# EasyEDA Pro project Clock_EasyEDA_Project_File.epro, board PCB
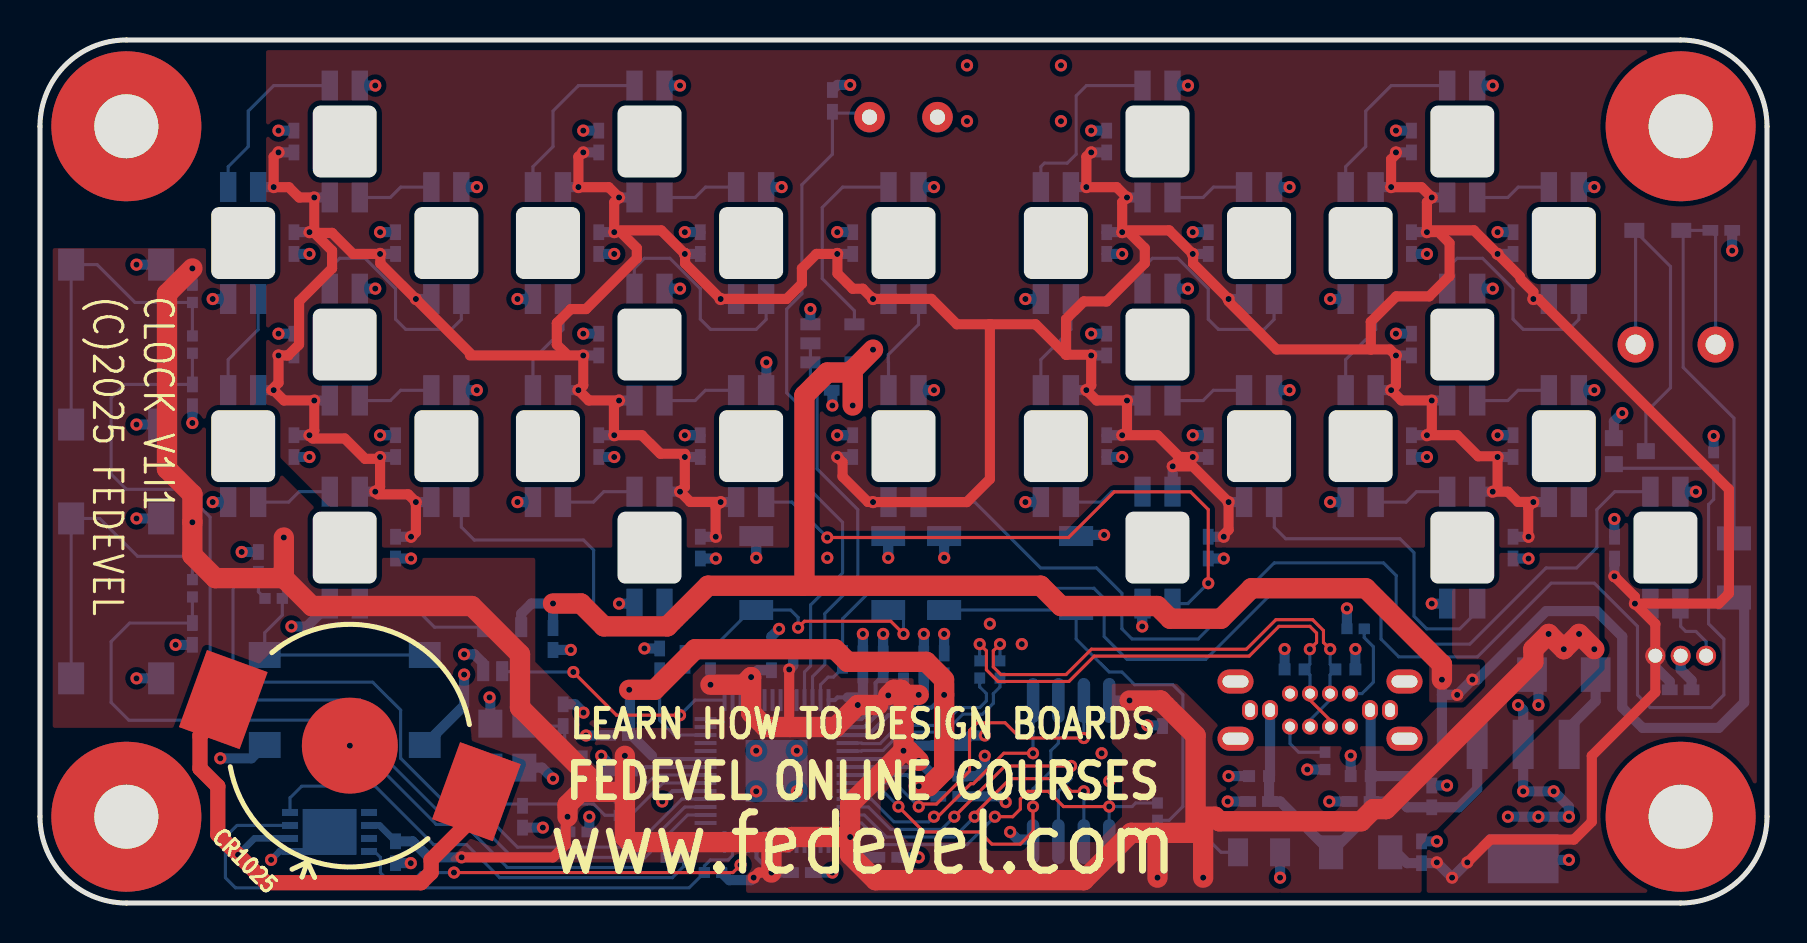
[diagram p2: board, top side]
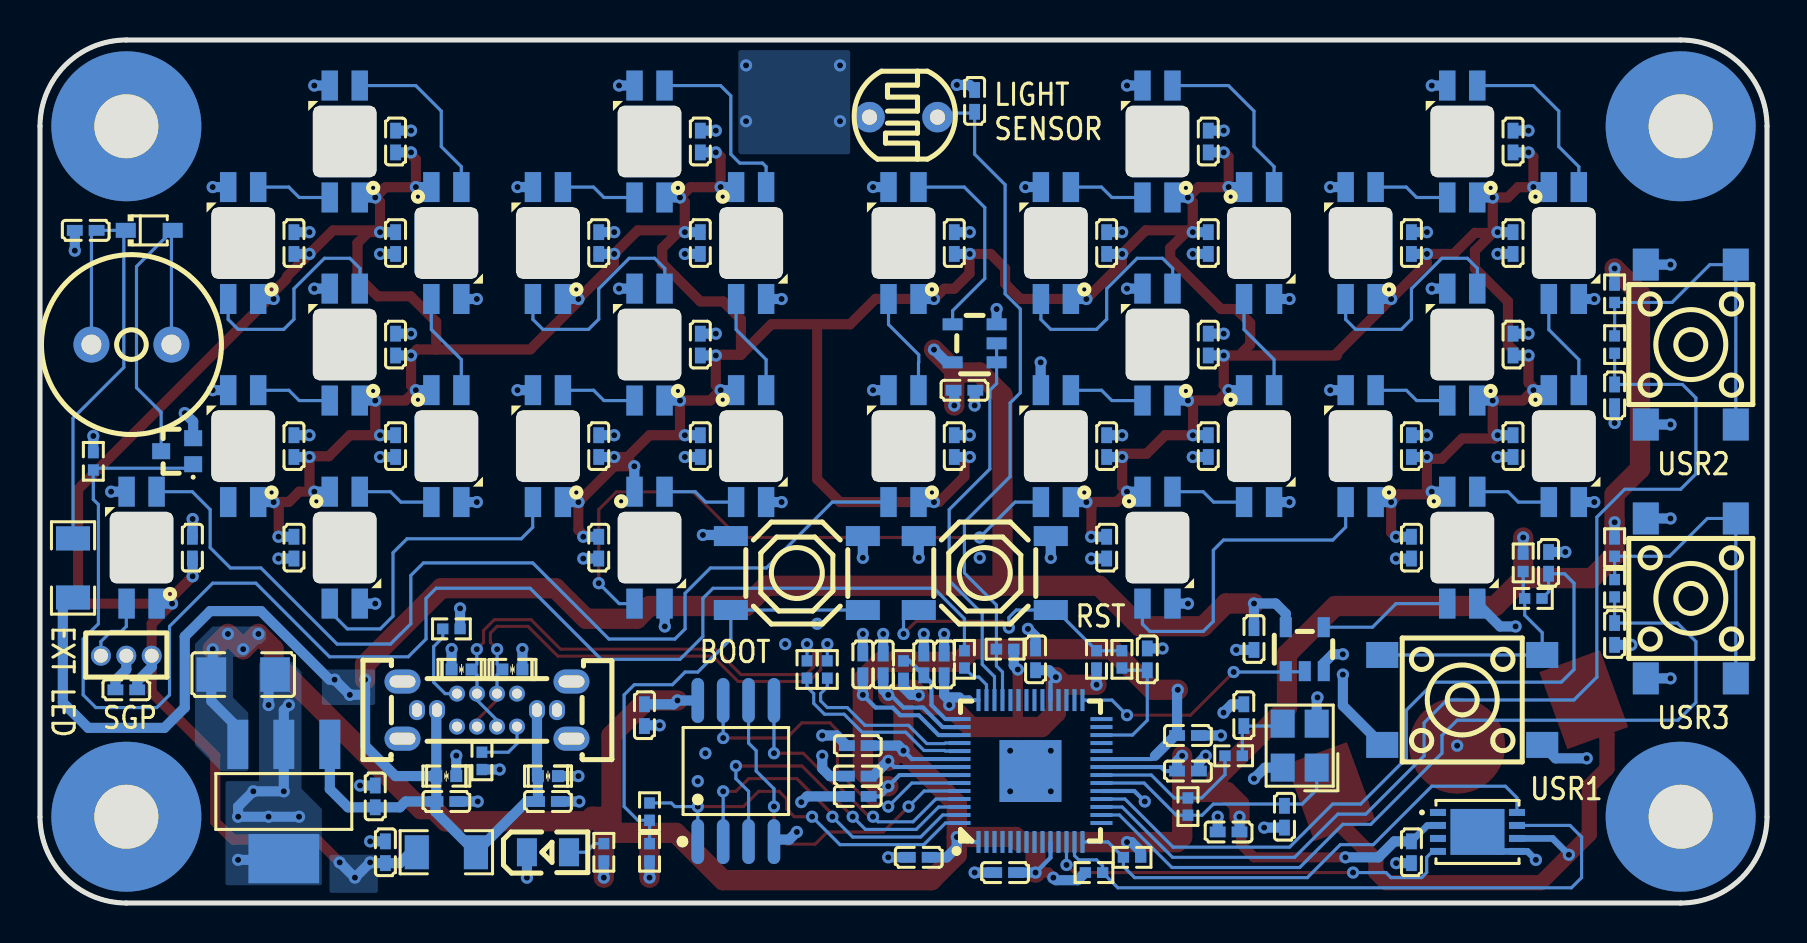
[diagram p3: board, bottom side, seen from below]

Outline 86.36 x 43.18 mm; copper layers: Top Layer, Inner1, Inner2, Bottom Layer. Coordinates in mm from the lower left corner of the outline.
Outline path: 0,38.86 0,4.32 arc(1.26,1.26) 4.32,0 82.04,0 arc(85.1,1.26) 86.36,4.32 86.36,38.86 arc(85.1,41.92) 82.04,43.18 4.32,43.18 arc(1.26,41.92) 0,38.86
Stack: Top Layer 0.035mm Outer layer thickness 1oz / Dielectric1 0.2104mm 7628 RC49% 8.6mil / Inner1 0.0152mm Inner layer thickness / Dielectric2 1.065mm 1.1mm H/HOZ Copper / Inner2 0.0152mm Inner layer thickness / Dielectric3 0.2104mm 7628 RC49% 8.6mil / Bottom Layer 0.035mm Outer layer thickness 1oz

## Design rules (mm)
net CON_USB_N: USB_CON
net CON_USB_P: USB_CON
net USB_N: USB
net USB_P: USB
template: User Custom Config
spacing copperThickness1oz (default): track to track 0.178, other pairs 0.076 to 0.305
spacing copperThickness2oz: track to track 0.203, other pairs 0.152 to 0.3
spacing copperThicknessInner0.5oz: track to track 0.089, other pairs 0.152 to 0.3
track width copperThickness1oz (default): min 0.152, default 0.203, max 2.54
track width copperThickness2oz: min 0.203, default 0.254, max 2.54
track width copperThickness0.5oz: min 0.089, default 0.254, max 2.54
differential pair differentialPair (default): width min 0.155, default 0.155, max 0.203; gap min 0.178, default 0.191
via viaSize (default): diameter min 0.61, default 0.61, max 10; hole min 0.305, default 0.305, max 6.299

## Placement (name value [footprint] x y rotation side)
BUZZER1  2.7kHz  [BUZ-TH_BD9.0-P4.00-D0.6-FD]  81.79 27.94 180 bottom
C101  2.2uF  [C0402]  26.92 3.56 180 bottom
C102  100nF  [C0402]  45.47 7.87 180 bottom
C103  100nF  [C0402]  45.47 6.35 180 bottom
C104  100nF  [C0402]  41.15 11.94 270 bottom
C105  2.2uF  [C0402]  42.16 11.94 270 bottom
C106  2.2uF  [C0402]  44.2 11.94 270 bottom
C107  2.2uF  [C0402]  45.21 11.94 270 bottom
C108  100nF  [C0402]  45.47 5.33 180 bottom
C109  100nF  [C0402]  28.96 8.38 0 bottom
C110  1uF  [C0402]  69.09 2.54 270 bottom
C111  1uF  [C0402]  69.6 5.33 270 bottom
C112  47uF  [C1206]  76.2 11.43 0 bottom
C113  100nF  [C0402]  36.58 12.19 270 bottom
C114  100nF  [C0402]  28.96 6.6 0 bottom
C115  100nF  [C0402]  38.1 1.52 180 bottom
C116  100nF  [C0402]  42.42 2.29 180 bottom
C118  1uF  [C0402]  60.96 5.08 0 bottom
C119  1uF  [C0402]  66.04 5.08 0 bottom
C123  15pF  [C0402]  24.13 4.32 270 bottom
C124  15pF  [C0402]  26.16 9.4 90 bottom
C125  100nF  [C0402]  25.65 13.21 90 bottom
C126  100nF  [C0402]  56.13 9.4 90 bottom
C127  100nF  [C0402]  30.99 12.19 270 bottom
C210  100nF  [C0402]  17.78 17.78 90 bottom
C211  100nF  [C0402]  12.7 22.86 90 bottom
C212  100nF  [C0402]  12.7 33.02 90 bottom
C213  100nF  [C0402]  12.7 38.1 270 bottom
C214  100nF  [C0402]  17.78 33.02 270 bottom
C215  100nF  [C0402]  12.7 27.94 270 bottom
C216  100nF  [C0402]  17.78 22.86 270 bottom
C217  100nF  [C0402]  33.02 17.78 90 bottom
C218  100nF  [C0402]  27.94 22.86 90 bottom
C219  100nF  [C0402]  27.94 33.02 90 bottom
C220  100nF  [C0402]  27.94 38.1 270 bottom
C221  100nF  [C0402]  33.02 33.02 270 bottom
C222  100nF  [C0402]  27.94 27.94 270 bottom
C223  100nF  [C0402]  33.02 22.86 270 bottom
C224  100nF  [C0402]  58.42 17.78 90 bottom
C225  100nF  [C0402]  53.34 22.86 90 bottom
C226  100nF  [C0402]  53.34 33.02 90 bottom
C227  100nF  [C0402]  53.34 38.1 270 bottom
C228  100nF  [C0402]  58.42 33.02 270 bottom
C229  100nF  [C0402]  53.34 27.94 270 bottom
C230  100nF  [C0402]  58.42 22.86 270 bottom
C231  100nF  [C0402]  73.66 17.78 90 bottom
C232  100nF  [C0402]  68.58 22.86 90 bottom
C233  100nF  [C0402]  68.58 33.02 90 bottom
C234  100nF  [C0402]  68.58 38.1 270 bottom
C235  100nF  [C0402]  73.66 33.02 270 bottom
C236  100nF  [C0402]  68.58 27.94 270 bottom
C237  100nF  [C0402]  73.66 22.86 270 bottom
C238  100nF  [C0402]  40.64 33.02 270 bottom
C239  100nF  [C0402]  40.64 22.86 270 bottom
C240  100nF  [C0402]  78.74 17.78 270 bottom
C241  100nF  [C0402]  82.04 10.67 180 bottom
C242  100nF  [C0402]  40.13 25.65 0 bottom
C243  1uF  [C0402]  84.07 33.66 180 bottom
C244  100nF  [C0402]  10.92 17.02 270 bottom
C245  100nF  [C0402]  7.62 25.4 90 bottom
C246  100nF  [C0402]  7.62 13.46 90 bottom
C247  15pF  [C0402]  39.62 40.13 270 bottom
C248  1uF  [C0402]  17.78 2.54 90 bottom
D101  GG0402052R542P  [D0402-BI]  60.96 6.35 0 bottom
D102  GG0402052R542P  [D0402-BI]  66.04 6.35 0 bottom
D103  GG0402052R542P  [D0402-BI]  62.74 11.68 0 bottom
D104  GG0402052R542P  [D0402-BI]  65.28 11.68 180 bottom
D105  1N4148WS  [SOD-323_L1.8-W1.3-LS2.5-RD]  80.9 33.66 180 bottom
J101  MC-110LD-L93  [USB-C-TH_MC-110LD-L93_1]  64.01 9.65 180 bottom
J201  1271WV-3P  [HDR-TH_3P-P1.27-V-M]  82.04 12.37 0 bottom
LED102  KT-0805G  [LED0805-R-RD]  60.96 2.54 180 bottom
LED201  SK6812MINI-E  [LED-SMD_L3.2-W2.8-TR]  15.24 17.78 90 bottom
LED202  SK6812MINI-E  [LED-SMD_L3.2-W2.8-TR]  10.16 22.86 90 bottom
LED203  SK6812MINI-E  [LED-SMD_L3.2-W2.8-TR]  10.16 33.02 90 bottom
LED204  SK6812MINI-E  [LED-SMD_L3.2-W2.8-TR]  15.24 38.1 270 bottom
LED205  SK6812MINI-E  [LED-SMD_L3.2-W2.8-TR]  20.32 33.02 270 bottom
LED206  SK6812MINI-E  [LED-SMD_L3.2-W2.8-TR]  15.24 27.94 270 bottom
LED207  SK6812MINI-E  [LED-SMD_L3.2-W2.8-TR]  20.32 22.86 270 bottom
LED208  SK6812MINI-E  [LED-SMD_L3.2-W2.8-TR]  30.48 17.78 90 bottom
LED209  SK6812MINI-E  [LED-SMD_L3.2-W2.8-TR]  25.4 22.86 90 bottom
LED210  SK6812MINI-E  [LED-SMD_L3.2-W2.8-TR]  25.4 33.02 90 bottom
LED211  SK6812MINI-E  [LED-SMD_L3.2-W2.8-TR]  30.48 38.1 270 bottom
LED212  SK6812MINI-E  [LED-SMD_L3.2-W2.8-TR]  35.56 33.02 270 bottom
LED213  SK6812MINI-E  [LED-SMD_L3.2-W2.8-TR]  30.48 27.94 270 bottom
LED214  SK6812MINI-E  [LED-SMD_L3.2-W2.8-TR]  35.56 22.86 270 bottom
LED215  SK6812MINI-E  [LED-SMD_L3.2-W2.8-TR]  55.88 17.78 90 bottom
LED216  SK6812MINI-E  [LED-SMD_L3.2-W2.8-TR]  50.8 22.86 90 bottom
LED217  SK6812MINI-E  [LED-SMD_L3.2-W2.8-TR]  50.8 33.02 90 bottom
LED218  SK6812MINI-E  [LED-SMD_L3.2-W2.8-TR]  55.88 38.1 270 bottom
LED219  SK6812MINI-E  [LED-SMD_L3.2-W2.8-TR]  60.96 33.02 270 bottom
LED220  SK6812MINI-E  [LED-SMD_L3.2-W2.8-TR]  55.88 27.94 270 bottom
LED221  SK6812MINI-E  [LED-SMD_L3.2-W2.8-TR]  60.96 22.86 270 bottom
LED222  SK6812MINI-E  [LED-SMD_L3.2-W2.8-TR]  71.12 17.78 90 bottom
LED223  SK6812MINI-E  [LED-SMD_L3.2-W2.8-TR]  66.04 22.86 90 bottom
LED224  SK6812MINI-E  [LED-SMD_L3.2-W2.8-TR]  66.04 33.02 90 bottom
LED225  SK6812MINI-E  [LED-SMD_L3.2-W2.8-TR]  71.12 38.1 270 bottom
LED226  SK6812MINI-E  [LED-SMD_L3.2-W2.8-TR]  76.2 33.02 270 bottom
LED227  SK6812MINI-E  [LED-SMD_L3.2-W2.8-TR]  71.12 27.94 270 bottom
LED228  SK6812MINI-E  [LED-SMD_L3.2-W2.8-TR]  76.2 22.86 270 bottom
LED229  SK6812MINI-E  [LED-SMD_L3.2-W2.8-TR]  43.18 33.02 270 bottom
LED230  SK6812MINI-E  [LED-SMD_L3.2-W2.8-TR]  43.18 22.86 270 bottom
LED231  SK6812MINI-E  [LED-SMD_L3.2-W2.8-TR]  81.28 17.78 270 bottom
MH205  -  [MH_7.5X3.2MM_RF_v1.0]  4.32 4.32 0 top
MH206  -  [MH_7.5X3.2MM_RF_v1.0]  82.04 4.32 0 top
MH207  -  [MH_7.5X3.2MM_RF_v1.0]  4.32 38.86 0 top
MH208  -  [MH_7.5X3.2MM_RF_v1.0]  82.04 38.86 0 top
Q1  2N7002BKW,115  [SOT-323_L2.0-W1.3-P1.30-LS2.1-BR]  79.5 22.61 180 bottom
R101  200Ω  [R0402]  43.18 11.68 90 bottom
R102  100mΩ  [R1206]  66.04 2.54 0 bottom
R104  1kΩ  [R0402]  58.17 2.54 270 bottom
R109  27Ω  [R0402]  46.99 11.68 270 bottom
R111  27Ω  [R0402]  48.01 11.68 270 bottom
R118  5.1kΩ  [R0402]  65.79 13.72 0 bottom
R119  5.1kΩ  [R0402]  64.26 7.11 90 bottom
R120  1MΩ  [R0402]  28.96 4.83 270 bottom
R121  1kΩ  [R0402]  26.67 7.37 0 bottom
R122  100kΩ  [R0402]  55.88 2.54 270 bottom
R123  10kΩ  [R0402]  33.53 12.19 270 bottom
R124  1kΩ  [R0402]  55.88 4.57 90 bottom
R125  27Ω  [R0402]  32.26 12.19 270 bottom
R126  27Ω  [R0402]  40.13 12.19 90 bottom
R127  150Ω  [R1206]  84.71 16.76 270 bottom
R128  10kΩ  [R0402]  83.69 22.1 270 bottom
R129  10kΩ  [R0402]  12.19 17.02 90 bottom
R130  27Ω  [R0402]  11.68 15.24 180 bottom
R131  10kΩ  [R0402]  7.62 30.48 90 bottom
R132  27Ω  [R0402]  7.62 27.94 270 bottom
R133  10kΩ  [R0402]  7.62 17.78 90 bottom
R134  27Ω  [R0402]  7.62 15.75 270 bottom
R135  GL5528(10-20)  [RES-TH_L5.1-W4.3-P3.40-D0.5]  43.18 39.32 270 bottom
R136  10kΩ  [R0402]  38.1 12.7 180 bottom
R137  10kΩ  [R0402]  31.75 2.29 180 bottom
R138  10kΩ  [R0402]  33.65 1.52 0 bottom
SW101  TS-1187A-B-A-B  [SW-SMD_4P-L5.1-W5.1-P3.70-LS6.5-TL-2]  48.51 16.51 180 bottom
SW102  TS-1187A-B-A-B  [SW-SMD_4P-L5.1-W5.1-P3.70-LS6.5-TL-2]  39.12 16.51 180 bottom
SW103  DTSM-62K-V-T/R  [KEY-SMD_4P-L6.2-W6.2-P4.50-LS9.0]  15.24 10.16 0 bottom
SW104  DTSM-62K-V-T/R  [KEY-SMD_4P-L6.2-W6.2-P4.50-LS9.0]  3.81 27.94 90 bottom
SW105  DTSM-62K-V-T/R  [KEY-SMD_4P-L6.2-W6.2-P4.50-LS9.0]  3.81 15.24 90 bottom
U101  RP2040  [LQFN-56_L7.0-W7.0-P0.4-EP_1]  36.83 6.6 90 bottom
U102  LM3940IMP-3.3/NOPB  [SOT-223_L6.5-W3.5-P2.30-LS7.0-BR]  74.17 5.08 90 bottom
U103  SN74LV1T34DBVR  [SOT-23-5_L2.9-W1.6-P0.95-LS2.8-BR]  23.11 12.7 270 bottom
U104  W25Q128JVSIQ  [SOIC-8_L5.3-W5.3-P1.27-LS8.0-BL]  51.56 6.6 180 bottom
U105  SN74LV1T34DBVR  [SOT-23-5_L2.9-W1.6-P0.95-LS2.8-BR]  39.62 28 180 bottom
U106  MAX31343ETAY+T  [TDFN-8_L4.0-W3.0-P0.50-BL-EP]  14.48 3.56 270 bottom
U107  MY-1025-01  [BAT-SMD_MY-1025-01_1]  15.49 7.87 160 top
Y101  ABM8-272-T3  [CRYSTAL-SMD_4P-L3.2-W2.5-BL]  23.37 7.87 90 bottom

## Footprints (pads in the part's own frame, mm; a bottom-side part is the same pattern mirrored in y, then rotated)
BAT-SMD_MY-1025-01_1
  rect 3.23x4.1 smd: 1(-6.735,0) 2(6.735,0)
  round 4.8 smd: 3(0,0)
BUZ-TH_BD9.0-P4.00-D0.6-FD
  round 1.8 hole 1: 1(-2,0) 2(2,0)
C0402
  rect 0.79x0.54 smd: 1(-0.545,0) 2(0.545,0)
C1206
  rect 1.485x1.728 smd: 1(-1.593,0) 2(1.593,0)
CRYSTAL-SMD_4P-L3.2-W2.5-BL
  rect 1.4x1.2 smd: 1(-1.1,-0.85) 2(1.1,-0.85) 3(1.1,0.85) 4(-1.1,0.85)
D0402-BI
  rect 0.6x0.6 smd: 1(-0.5,0) 2(0.5,0)
HDR-TH_3P-P1.27-V-M
  round 1 hole 0.7: 1(-1.27,0) 2(0,0) 3(1.27,0)
KEY-SMD_4P-L6.2-W6.2-P4.50-LS9.0
  rect 1.6x1.3 smd: 1(-4,2.25) 2(4,2.25) 3(-4,-2.25) 4(4,-2.25)
LED0805-R-RD
  rect 1x1.399 smd: 1(1.05,0) 2(-1.05,0)
LED-SMD_L3.2-W2.8-TR
  rect 1.5x0.82 smd: 1(2.8,0.75) 2(2.8,-0.75) 3(-2.8,-0.75) 4(-2.8,0.75)
LQFN-56_L7.0-W7.0-P0.4-EP_1
  rect 1.1x0.2 smd: 1(-3.55,2.6) 2(-3.55,2.2) 3(-3.55,1.8) 4(-3.55,1.4) 5(-3.55,1) 6(-3.55,0.6) 7(-3.55,0.2) 8(-3.55,-0.2) 9(-3.55,-0.6) 10(-3.55,-1) 11(-3.55,-1.4) 12(-3.55,-1.8) 13(-3.55,-2.2) 14(-3.55,-2.6) 29(3.55,-2.6) 30(3.55,-2.2) 31(3.55,-1.8) 32(3.55,-1.4) 33(3.55,-1) 34(3.55,-0.6) 35(3.55,-0.2) 36(3.55,0.2) 37(3.55,0.6) 38(3.55,1) 39(3.55,1.4) 40(3.55,1.8) 41(3.55,2.2) 42(3.55,2.6)
  rect 0.2x1.1 smd: 15(-2.6,-3.55) 16(-2.2,-3.55) 17(-1.8,-3.55) 18(-1.4,-3.55) 19(-1,-3.55) 20(-0.6,-3.55) 21(-0.2,-3.55) 22(0.2,-3.55) 23(0.6,-3.55) 24(1,-3.55) 25(1.4,-3.55) 26(1.8,-3.55) 27(2.2,-3.55) 28(2.6,-3.55) 43(2.6,3.55) 44(2.2,3.55) 45(1.8,3.55) 46(1.4,3.55) 47(1,3.55) 48(0.6,3.55) 49(0.2,3.55) 50(-0.2,3.55) 51(-0.6,3.55) 52(-1,3.55) 53(-1.4,3.55) 54(-1.8,3.55) 55(-2.2,3.55) 56(-2.6,3.55)
  rect 3.1x3.1 smd: 57(0,0)
MH_7.5X3.2MM_RF_v1.0
  round 7.5 hole 3.2: 1(0,0)
R0402
  rect 0.566x0.54 smd: 1(-0.433,0) 2(0.433,0)
R1206
  rect 1.208x1.701 smd: 1(-1.479,0) 2(1.479,0)
RES-TH_L5.1-W4.3-P3.40-D0.5
  round 1.524 hole 0.762: 1(0,1.7) 2(0,-1.7)
SOD-323_L1.8-W1.3-LS2.5-RD
  rect 1x0.75 smd: 1(-1.173,0) 2(1.173,0)
SOIC-8_L5.3-W5.3-P1.27-LS8.0-BL
  oval 0.63x2.25 smd: 1(-1.905,-3.53) 2(-0.635,-3.53) 3(0.635,-3.53) 4(1.905,-3.53) 5(1.905,3.53) 6(0.635,3.53) 7(-0.635,3.53) 8(-1.905,3.53)
SOT-23-5_L2.9-W1.6-P0.95-LS2.8-BR
  rect 1x0.6 smd: 1(1.1,-0.95) 2(1.1,0) 3(1.1,0.95) 4(-1.1,0.95) 5(-1.1,-0.95)
SOT-223_L6.5-W3.5-P2.30-LS7.0-BR
  rect 2.465x1.05 smd: 1(2.857,-2.3) 2(2.857,0) 3(2.857,2.3)
  rect 2.465x3.54 smd: 4(-2.857,0)
SOT-323_L2.0-W1.3-P1.30-LS2.1-BR
  rect 0.9x0.8 smd: 1(0.8,-0.65) 2(0.8,0.65) 3(-0.8,0)
SW-SMD_4P-L5.1-W5.1-P3.70-LS6.5-TL-2
  rect 1.7x1 smd: 1(-3.3,1.85) 2(3.3,1.85) 3(-3.3,-1.85) 4(3.3,-1.85)
TDFN-8_L4.0-W3.0-P0.50-BL-EP
  rect 0.35x0.8 smd: 1(-0.975,-1.975) 2(-0.325,-1.975) 3(0.325,-1.975) 4(0.975,-1.975) 5(0.975,1.975) 6(0.325,1.975) 7(-0.325,1.975) 8(-0.975,1.975)
  rect 2.3x2.7 smd: 9(0,0)
USB-C-TH_MC-110LD-L93_1
  oval 1.8x1.2 hole 1.3x0.6: 13(-4.225,-1.43) 13(-4.225,1.43) 13(4.225,-1.43) 13(4.225,1.43)
  oval 0.8x1 hole 0.5x0.7: A1B12(3.5,0) A4B9(2.5,0) A9B4(-2.5,0) A12B1(-3.5,0)
  round 0.8 hole 0.5: A5(1.5,-0.825) A6(0.5,-0.825) A7(-0.5,-0.825) A8(-1.5,-0.825) B5(-1.5,0.825) B6(-0.5,0.825) B7(0.5,0.825) B8(1.5,0.825)

## Nets
As in the schematic.

Pads without a net: J101 A8 B8; LED228 2; U101 2 3 4 5 6 7 8 9 11 15 24 25 27 28 30 31 32 34 35 36 37 38; U106 1 3

## Via types
v1: diameter 0.61, hole 0.305, Top Layer to Bottom Layer, 263 vias

## Routing (per net, layer and track width the routed paths; a pad name or vN(x,y) marks a point on that pad's centre or on a via; arc(x,y) is an arc through that point)
+1V1: length 41.5
  Top Layer w1.016: 45.21,11.18 44.32,12.06 40.39,12.06 39.75,12.7 32.77,12.7 30.73,10.67 v1(29.46,10.67) ; 45.21,10.98 v1(45.21,10.41) 45.21,6.6 44.45,5.84 v1(43.94,5.84)
  Bottom Layer w0.205: U101.50 43.38,6.4 v1(43.94,5.84) 43.94,5.72 44.32,5.33 C108.2 ; U101.45 41.42,8.4 42.42,9.4 43.34,9.4 43.72,9.78 44.58,9.78 v1(45.21,10.41) ; 30.61,7.37 30.77,7.2 U101.23
  Bottom Layer w0.508: 30.61,7.37 29.59,8.38 C109.2 29.5,10.63 v1(29.46,10.67) ; C107.2 v1(45.21,10.41)
+3V3: length 213.2
  Top Layer w0.508: 37.51,8.81 37.46,8.85 v1(37.46,11.68) ; v1(35.69,1.27) 35.94,1.52 v1(36.58,1.52) ; v1(21.08,2.29) 25.65,2.29 26.29,2.92 26.29,4.23 v1(26.38,4.32)
  Top Layer w1.016: 41.91,9.91 v1(40.89,9.91) 39.79,8.81 36.28,8.81 35.56,9.53 v1(35.56,11.3) 35.18,10.92 v1(33.53,10.92) ; 57.79,3.92 57.79,3.51 55.87,3.51 ; 57.79,3.92 57.93,4.06 ; 57.79,3.92 57.79,8.38 56.03,10.13 v1(54.48,10.13) ; 12.19,16.26 13.59,14.86 21.59,14.86 24,12.45 24,9.78 27.52,6.26 27.52,5.56 ; 12.19,16.26 8.76,16.26 7.62,17.4 v1(7.62,19.05) 7.62,20.45 6.35,21.72 6.35,30.48 v1(7.62,31.75) ; 12.19,16.26 v1(12.19,18.29) ; 27.52,5.56 29.25,5.56 ; 27.52,5.56 27.03,5.56 26.38,4.92 v1(26.38,4.32) ; 29.25,5.56 v1(29.25,7.37) ; 29.25,5.56 29.25,3.3 29.5,3.05 v1(32,3.05) 36.51,3.05 ; 36.51,3.05 36.58,2.98 v1(36.58,1.52) ; 36.51,3.05 37.34,3.05 37.59,3.3 v1(40.51,3.3) ; 57.93,4.06 58.17,3.83 v1(58.17,1.27) ; 57.93,4.06 58.19,4.32 58.75,4.32 58.98,4.09 66.07,4.09 66.67,4.7 67.31,4.7 74.68,12.07 74.68,12.7 v1(75.44,13.46) v1(76.2,12.7) v1(76.96,13.46) v1(77.72,12.7) ; v1(43.18,7.62) 43.18,10.29 43.31,10.41 ; v1(43.18,7.62) 43.43,7.62 v1(43.94,7.11) ; v1(43.18,7.62) 40.51,4.95 v1(40.51,3.3) ; 55.87,3.51 55.88,3.5 v1(55.88,1.27) ; 55.87,3.51 54.56,3.51 52.2,1.14 41.78,1.14 40.51,2.41 v1(40.51,3.3) ; 43.31,10.41 43.05,10.67 42.7,10.67 v1(42.42,10.39) ; 43.31,10.41 v1(43.94,10.41)
  Bottom Layer w0.205: C114.2 30.1,6.6 30.3,6.8 U101.22 ; v1(35.56,11.3) 35.83,11.03 U101.33 ; v1(43.94,7.11) 43.63,6.8 U101.49 ; U101.42 39.74,10.15 39.88,10.29 40.39,10.29 ; U101.10 35.83,2.27 v1(36.58,1.52) ; v1(43.94,10.41) 43.82,10.41 43.18,9.78 42.2,9.78 41.22,8.8 U101.44 ; v1(43.18,7.62) 42.76,7.2 U101.48 ; v1(40.51,3.3) 40.01,3.3 39.76,3.05 U101.1
  Bottom Layer w0.33: C248.2 16.98,3.88 16.45,3.88
  Bottom Layer w0.508: 40.39,10.29 41.02,10.29 ; 41.02,10.29 40.89,10.16 v1(40.89,9.91) ; 41.02,10.29 41.15,10.41 C104.2 ; v1(40.51,3.3) 40.51,2.79 41.02,2.29 C116.2 ; v1(35.56,11.3) 35.9,11.65 C113.2 ; R122.2 v1(55.88,1.27) ; R137.2 31.32,2.58 31.78,3.05 v1(32,3.05) ; C114.2 29.5,7.11 v1(29.25,7.37) ; R123.2 v1(33.53,10.92) ; U104.8 v1(54.48,10.13) 54.67,9.94 C126.2 ; C106.2 44.2,10.67 v1(43.94,10.41) ; v1(43.94,7.11) 44.7,6.35 C103.2 ; C101.2 v1(26.38,4.32) ; R133.2 v1(7.62,19.05) ; R131.2 v1(7.62,31.75) ; 43.18,11.25 43.18,10.8 42.8,10.41 42.42,10.41 ; R138.2 34.47,1.14 35.56,1.14 v1(35.69,1.27) ; C115.2 v1(36.58,1.52) ; C102.2 43.43,7.87 v1(43.18,7.62) ; R136.2 37.67,11.89 v1(37.46,11.68) ; C248.2 18.63,3.09 19.43,2.29 v1(21.08,2.29) ; U102.3 76.47,8.78 77.79,10.1 C112.2 77.72,11.5 v1(77.72,12.7) ; R104.2 v1(58.17,1.27) ; R129.2 v1(12.19,18.29)
+3V3_A: length 4.7
  Bottom Layer w0.205: U101.43 41.08,9.2 41.78,9.91 41.78,11.01 C105.2 42.89,12.12 R101.2
+3V_BAT: length 27.4
  Top Layer w0.762: 9.16,10.18 9.16,9.55 8,8.38 8,6.73 8.89,5.84 8.89,3.43 v1(9.91,2.41) 11.3,1.02 19.05,1.02 19.56,1.52 19.56,2.16 21.82,4.42 21.82,5.57
  Bottom Layer w0.33: v1(9.91,2.41) 10.72,3.23 U106.6
+5V_LEDS: length 308.3
  Top Layer w0.508: v1(41.66,30.22) 41.14,30.73 40.64,30.73 39.88,31.5 39.88,32.51 ; 51.31,27.43 49.78,28.96 47.5,28.96 ; 51.31,27.43 52.53,27.43 v1(52.57,27.4) 52.57,25.9 52.33,25.66 ; 51.31,27.43 51.31,29.21 52.2,30.1 53.34,30.1 55.24,32 55.24,32.77 54.45,33.56 v1(54.11,33.56) ; 28.7,23.5 28.7,24.89 v1(28.96,25.14) ; 54.14,23.41 55.88,23.41 56.93,22.35 ; 54.14,23.41 v1(54.11,23.41) ; 54.14,23.41 54.36,23.62 v1(54.36,25.14) ; v1(32.25,32.48) 31.07,33.66 28.71,33.66 28.71,35.06 28.95,35.3 ; 74.55,20.07 73.91,20.07 73.4,20.58 v1(72.64,20.58) ; 26.93,25.66 27.17,25.9 v1(27.17,27.4) 21.5,27.4 ; 26.93,25.66 27.44,25.15 28.83,25.15 ; 26.93,25.66 v1(26.92,25.66) ; 13.49,23.39 13.72,23.62 v1(13.72,25.14) ; 13.49,23.39 13.64,23.24 15.24,23.24 16.26,22.23 17.01,22.23 ; 13.49,23.39 v1(13.47,23.41) ; 32.26,22.48 31.02,22.48 30.1,23.41 v1(28.71,23.41) ; 52.33,25.66 52.84,25.15 54.36,25.15 ; 52.33,25.66 v1(52.32,25.66) ; v1(11.68,35.82) 11.68,37.34 11.94,37.59 ; v1(72.89,22.31) 72.89,20.69 ; 13.72,33.81 13.72,35.18 ; 79.76,14.98 79.76,14.99 79.76,15.32 v1(78.73,16.35) ; 79.76,14.98 83.95,14.98 84.45,15.49 84.45,20.7 74.93,30.23 74.68,30.23 ; 79.76,14.98 v1(79.76,14.98) ; 79.76,14.98 80.77,13.97 J201.1 80.77,10.54 77.6,7.37 77.6,4.06 76.71,3.18 72.52,3.18 v1(71.37,2.03) ; 16.77,20.58 17.01,20.82 17.01,22.23 ; 16.77,20.58 16.9,20.45 18.41,20.45 18.8,20.07 ; 16.77,20.58 v1(16.76,20.58) ; v1(28.71,33.56) 29.05,33.56 29.84,32.77 29.84,32.26 27.3,29.72 26.54,29.72 25.84,29.02 25.84,27.94 26.35,27.43 ; 11.56,25.65 11.93,26.02 v1(11.93,27.4) 12.41,27.4 12.95,27.94 12.95,30.1 14.61,31.75 14.61,32.64 13.72,33.53 ; v1(28.96,35.3) 28.95,35.3 ; 28.95,35.3 28.44,35.81 26.92,35.81 ; 52.58,37.59 52.32,37.34 v1(52.32,35.82) ; v1(69.35,23.41) 69.38,23.41 ; 69.38,23.41 70.87,23.41 71.92,22.35 72.9,22.35 ; 69.38,23.41 69.6,23.62 v1(69.6,25.14) ; 74.68,30.23 v1(74.68,30.22) ; 74.68,30.23 74.68,30.58 74.03,31.22 ; 32.01,20.58 32.25,20.82 v1(32.25,22.31) ; 32.01,20.58 32.52,20.07 33.91,20.07 ; 32.01,20.58 v1(32,20.58) ; 21.56,27.46 v1(18.8,30.22) 17.02,32 17.02,32.39 ; v1(13.72,35.3) 12.96,35.3 12.45,35.81 11.68,35.81 ; 11.93,27.43 11.94,27.43 ; 41.66,20.07 41.4,20.07 40.13,21.34 40.13,22.05 v1(39.87,22.31) ; 13.72,33.53 13.68,33.56 v1(13.47,33.56) ; 13.72,33.53 14.61,33.53 15.66,32.48 v1(17.01,32.48) ; 34.04,30.23 37.34,30.23 38.1,30.99 38.1,31.75 38.83,32.48 v1(39.87,32.48) ; 69.59,35.3 69.35,35.06 69.35,33.66 71.71,33.66 v1(72.89,32.48) 74.01,31.35 ; 69.59,35.3 v1(69.6,35.3) ; 69.59,35.3 69.08,35.81 67.56,35.81 ; v1(17.01,22.31) 17.01,22.23 ; 66.55,27.7 61.84,27.7 59.44,30.1 ; 66.55,27.7 67.5,27.7 v1(67.81,27.4) 67.81,25.9 67.57,25.66 ; 66.55,27.7 66.55,29.08 67.82,30.35 69.47,30.35 70.48,31.37 70.48,33.02 69.94,33.56 v1(69.35,33.56) ; 47.5,28.96 47.5,21.21 46.35,20.06 v1(41.66,20.06) ; 47.5,28.96 45.85,28.96 44.58,30.23 41.66,30.23 ; 54.35,35.3 53.84,35.81 52.32,35.81 ; 54.35,35.3 v1(54.36,35.3) ; 54.35,35.3 54.11,35.06 54.11,33.66 56.47,33.66 v1(57.65,32.48) ; v1(59.44,30.22) 57.66,32 57.66,32.51 ; 74.42,18.29 74.42,19.81 v1(74.68,20.06) ; 57.66,22.31 v1(57.65,22.31) 57.11,22.31 ; 57.11,22.31 56.93,22.31 ; 57.11,22.31 v1(56.64,21.85) 57.65,21.85 v1(59.44,20.06) 59.44,18.67 59.18,18.42 ; 27.05,37.47 26.92,37.34 v1(26.92,35.82) ; v1(11.68,25.66) 12.2,25.15 13.72,25.15 ; 33.78,18.42 33.78,19.81 v1(34.04,20.06) ; 67.57,25.66 68.08,25.15 69.6,25.15 ; 67.57,25.66 v1(67.56,25.66) ; 18.54,18.29 18.8,18.54 v1(18.8,20.06) ; 32.26,32.51 32.26,32 v1(34.04,30.22) ; 67.82,37.47 67.56,37.21 v1(67.56,35.82)
  Bottom Layer w0.508: C211.2 v1(13.47,23.41) ; C241.2 81.5,11.09 80.77,11.81 J201.1 ; 12.7,33.56 v1(13.47,33.56) ; C227.2 v1(52.57,37.56) ; C223.2 v1(32.25,22.31) ; v1(78.73,16.35) 78.73,17.22 C240.2 ; C214.2 v1(17.01,32.48) ; LED218.1 v1(54.36,35.3) ; C234.2 v1(67.81,37.56) ; LED210.1 v1(26.92,35.82) ; LED213.1 v1(28.96,25.14) ; 68.58,33.56 v1(69.35,33.56) ; LED223.1 v1(67.56,25.66) ; 68.58,27.4 v1(67.81,27.4) ; LED215.1 56.64,20.59 v1(56.64,21.85) ; C239.2 v1(39.87,22.31) ; LED207.1 v1(18.8,20.06) ; 27.94,27.4 v1(27.17,27.4) ; LED217.1 v1(52.32,35.82) ; LED209.1 v1(26.92,25.66) ; C225.2 v1(54.11,23.41) ; LED229.1 v1(41.66,30.22) ; LED219.1 v1(59.44,30.22) ; C237.2 v1(72.89,22.31) ; C235.2 v1(72.89,32.48) ; LED211.1 v1(28.96,35.3) ; 12.7,27.4 v1(11.93,27.4) ; LED204.1 v1(13.72,35.3) ; LED205.1 v1(18.8,30.22) ; C224.2 v1(59.19,18.33) ; LED202.1 v1(11.68,25.66) ; LED226.1 v1(74.68,30.22) ; C213.2 v1(11.93,37.56) ; C228.2 v1(57.65,32.48) ; LED231.1 v1(79.76,14.98) ; R102.2 67.82,2.54 68.36,2 C110.2 69.81,2 v1(69.85,2.03) v1(70.61,1.27) v1(71.37,2.03) ; LED228.1 v1(74.68,20.06) ; C217.2 v1(33.79,18.33) ; LED220.1 v1(54.36,25.14) ; LED206.1 v1(13.72,25.14) ; LED208.1 v1(32,20.58) ; LED214.1 v1(34.04,20.06) ; LED212.1 v1(34.04,30.22) ; LED203.1 v1(11.68,35.82) ; C220.2 v1(27.17,37.56) ; LED224.1 v1(67.56,35.82) ; C231.2 v1(74.43,18.33) ; C232.2 v1(69.35,23.41) ; LED216.1 v1(52.32,25.66) ; C210.2 v1(18.55,18.33) ; LED222.1 v1(72.64,20.58) ; C230.2 v1(57.65,22.31) ; 53.34,33.56 v1(54.11,33.56) ; 53.34,27.4 v1(52.57,27.4) ; LED230.1 v1(41.66,20.06) ; C221.2 v1(32.25,32.48) ; LED225.1 v1(69.6,35.3) ; LED221.1 v1(59.44,20.06) ; C238.2 v1(39.87,32.48) ; 27.94,33.56 v1(28.71,33.56) ; LED227.1 v1(69.6,25.14) ; LED201.1 v1(16.76,20.58) ; C216.2 v1(17.01,22.31) ; C218.2 v1(28.71,23.41)
+5V_USB: length 130.2
  Top Layer w1.016: 40.64,26.67 40.51,26.54 39.37,26.54 38.23,25.4 38.23,15.94 38.17,15.88 ; 40.64,26.67 v1(41.66,27.69) ; 40.64,26.67 v1(40.64,24.89) ; 38.17,15.88 33.4,15.88 31.37,13.84 28.19,13.84 27.05,14.99 v1(25.65,14.99) ; 38.17,15.88 50.04,15.88 51.05,14.86 55.88,14.86 56.52,14.22 59.05,14.22 60.58,15.75 66.29,15.75 70.1,11.94 v1(70.1,11.18)
  Bottom Layer w0.508: 70.1,10.42 v1(70.1,11.18) ; 70.1,10.42 70.74,10.42 ; 70.1,10.42 70.1,7.87 68.58,6.35 D102.2 ; D102.2 66.54,9.62 J101.A9B4 ; D102.2 66.54,5.12 C119.2 ; C125.2 v1(25.65,14.99) 24.57,14.99 24.06,14.48 U103.5 ; C119.2 66.58,4.56 R102.1 62.02,5.08 C118.2 61.46,5.12 D101.2 61.51,6.4 J101.A4B9 ; C119.2 68.07,5.08 68.36,4.79 C111.2 70.96,4.79 71.87,5.7 U102.1 ; v1(40.64,24.89) 40.64,25.62 C242.2 ; v1(41.66,27.69) 41.02,27.05 U105.5 ; v1(70.87,10.41) v1(71.63,11.18) 71.88,11.18 75.31,14.61 77.85,14.61 79.12,13.34 79.12,9.78 80.14,8.76 83.95,8.76 85.22,10.03 85.22,14.78 R127.2
GND: length 135.5
  Bottom Layer w0.205: U101.19 31.64,5.6 v1(31.11,5.08)
  Bottom Layer w0.33: U106.9 13.5,2.58 11.98,2.58 v1(11.56,2.16)
  Bottom Layer w0.508: LED226.3 v1(77.72,35.82) ; LED203.3 v1(8.64,30.22) ; C115.1 v1(39.62,1.52) ; LED219.3 v1(62.48,35.82) ; C109.1 v1(27.3,8.38) ; LED216.3 v1(49.28,20.06) ; LED102.2 v1(62.01,1.27) ; SW101.2 v1(45.21,17.27) ; C119.1 v1(64.47,5.08) ; C104.1 v1(41.15,13.46) ; v1(55.37,8.89) 56.1,8.89 C126.1 ; C101.1 v1(27.47,4.32) ; R118.1 v1(65.35,14.74) ; LED220.3 v1(57.4,30.74) ; LED212.3 v1(37.08,35.82) ; C107.1 v1(45.21,13.46) ; C247.1 39.88,40.93 v1(40.51,40.93) ; D101.1 v1(59.44,6.35) ; LED223.3 v1(64.52,20.06) ; C225.1 v1(54.11,22.31) ; C239.1 v1(39.87,23.41) ; 25.65,12.66 v1(26.54,12.66) ; C118.1 v1(59.39,5.08) ; v1(12.57,13.84) 13.35,13.84 LED201.3 ; C113.1 36.58,13.34 v1(36.96,13.72) ; SW105.2 v1(4.83,19.24) ; C242.1 39.62,25.62 v1(39.62,24.89) ; D103.1 v1(62.24,12.71) ; Y101.2 22.52,10.25 v1(22.48,10.29) ; D104.1 v1(65.78,12.71) ; v1(21.21,11.43) 21.21,9.88 SW103.2 ; SW104.2 v1(4.83,31.94) ; C123.2 v1(25.15,3.77) ; R128.1 v1(83.69,23.37) ; LED215.3 55.12,14.97 v1(55.12,13.84) ; C212.1 v1(13.47,32.48) ; C240.1 78.73,18.34 v1(78.73,19.21) ; 46.01,6.35 46.86,6.35 47.24,6.73 v1(47.24,7.37) ; v1(74.93,9.91) 74.93,11.11 C112.1 ; 46.01,7.87 46.52,8.38 v1(47.24,8.38) ; LED222.3 v1(69.6,14.98) ; 46.01,5.33 48.01,5.33 v1(48.29,5.05) ; 40.64,33.56 v1(39.87,33.56) ; v1(28.07,7.37) 28.41,7.02 C114.1 ; C243.1 v1(84.62,32.64) ; LED204.3 v1(16.76,40.9) ; LED225.3 v1(72.64,40.9) ; SW105.1 v1(4.83,11.24) ; LED202.3 v1(8.64,20.06) ; LED224.3 v1(64.52,30.22) ; C105.1 v1(42.16,13.46) ; C215.1 v1(11.93,28.48) ; C244.1 v1(10.08,17.56) ; LED228.3 v1(77.72,25.66) ; 82.59,10.67 82.59,11.14 82.04,11.68 J201.2 ; C127.1 v1(30.23,12.74) ; C217.1 v1(33.79,17.23) ; C231.1 v1(74.43,17.23) ; C220.1 v1(27.17,38.65) ; LED206.3 v1(16.76,30.74) ; v1(9.02,7.24) 10.57,7.24 SW103.1 ; U104.4 49.56,3.18 48.89,3.18 v1(48.51,3.56) ; 42.96,2.29 v1(43.94,2.29) ; U103.3 22.16,12 21.72,12.45 v1(21.21,12.45) ; v1(27.18,9.53) 26.76,9.94 C124.2 ; v1(79.12,24.51) 78.7,24.09 Q1.2 ; 33.02,33.56 v1(32.25,33.56) ; v1(76.45,2.16) 74.23,2.16 U102.4 ; LED213.3 v1(32,30.74) ; C110.1 v1(69.85,3.09) ; C222.1 v1(27.17,28.48) ; LED231.3 v1(82.8,20.58) ; LED227.3 v1(72.64,30.74) ; LED214.3 36.32,25.67 v1(36.32,27.05) ; C236.1 v1(67.81,28.48) ; v1(74.17,5.59) v1(75.69,5.59) 76.45,4.83 v1(76.45,4.32) v1(74.93,4.32) v1(73.41,4.32) ; U105.3 v1(38.52,29.72) ; LED210.3 v1(23.88,30.22) ; C245.1 v1(7.62,24.02) ; C218.1 v1(28.71,22.31) ; C248.1 v1(18.54,2) ; C211.1 v1(13.47,22.31) ; R119.1 v1(63.37,6.68) ; LED218.3 v1(57.4,40.9) ; 58.42,33.56 v1(57.65,33.56) ; C229.1 v1(52.57,28.48) ; C219.1 v1(28.71,32.48) ; C106.1 v1(44.2,13.46) ; C224.1 v1(59.19,17.23) ; C216.1 v1(17.01,23.41) ; C227.1 v1(52.57,38.65) ; C232.1 v1(69.35,22.31) ; LED207.3 v1(21.84,25.66) ; Y101.4 25.1,6.77 v1(25.65,6.22) ; SW104.1 v1(4.83,23.94) ; C210.1 v1(18.55,17.23) ; LED205.3 v1(21.84,35.82) ; C223.1 v1(32.25,23.41) ; LED208.3 v1(28.96,14.98) ; v1(73.91,9.91) 74.17,9.65 U102.2 74.17,5.72 ; C246.1 v1(6.78,12.92) ; SW102.1 v1(42.42,17.27) ; LED230.3 v1(44.7,25.66) ; C237.1 v1(72.89,23.41) ; LED211.3 v1(32,40.9) ; LED217.3 v1(49.28,30.22) ; C234.1 v1(67.81,38.65) ; LED221.3 v1(62.48,25.66) ; LED209.3 v1(23.88,20.06) ; SW101.1 51.87,18.42 v1(53.21,18.42) ; C226.1 v1(54.11,32.48) ; C213.1 v1(11.93,38.65) ; 73.66,33.56 v1(72.89,33.56) ; C233.1 v1(69.35,32.48) ; SW102.2 v1(35.82,17.27) ; D102.1 v1(65.54,7.38) ; C111.1 v1(70.36,5.88) ; C230.1 v1(57.65,23.41) ; 17.78,33.56 v1(17.01,33.56) ; LED229.3 v1(44.7,35.82)
  vias: v1(15.49,7.87) v1(35.81,7.62) v1(35.81,5.59) v1(37.85,7.62) v1(37.85,5.59) v1(39.37,17.27) v1(46.36,41.91) v1(46.36,39.12) v1(47.5,13.97) v1(49.1,12.95) v1(51.05,41.91) v1(51.05,39.12) v1(53.09,7.49) v1(53.47,6.1)
BUZZER: length 76.1
  Bottom Layer w0.157: 40.13,12.62 40.13,14.22 41.66,15.75 52.7,15.75 53.21,15.24 53.21,13.34 54.36,12.19 58.29,12.19 61.85,15.75 66.55,15.75 67.06,15.24 67.06,13.21 67.95,12.32 71.88,12.32 75.57,16 77.72,16 79.88,13.84 79.88,10.41 80.52,9.78 83.57,9.78 84.2,10.41 84.2,13.21 83.44,13.97 83.44,19.94 83.69,20.19 R128.2 83.61,21.75 78.9,21.75 Q1.1
BUZZER_RES: length 2.2
  Bottom Layer w0.157: U101.41 39.03,10.92 39.41,11.3 39.68,11.3 R126.1
CLK_1HZ: length 21
  Top Layer w0.157: v1(20.7,1.52) 34.65,1.52 v1(35.03,1.91)
  Bottom Layer w0.157: v1(20.7,1.52) 19.05,1.52 18.8,1.27 17.27,1.27 17.02,1.52 17.02,2.29 16.72,2.58 16.45,2.58 ; U101.12 v1(35.03,1.91)
CON_USB_N: length 25.7
  Top Layer w0.155: v1(46.99,12.95) 47.33,12.62 47.33,11.67 47.91,11.08 51.45,11.08 52.72,12.35 60.47,12.35 61.96,13.84 63.5,13.84 63.84,13.51 63.84,13.04 v1(63.5,12.7) ; J101.A7 64.51,9.15 63.51,10.15 J101.B7
  Bottom Layer w0.155: v1(63.5,12.7) 63.5,11.95 D103.2 63.51,11.41 J101.B7 ; R109.1 v1(46.99,12.95)
CON_USB_P: length 25.7
  Top Layer w0.155: v1(64.52,12.7) 64.18,13.04 64.18,13.63 63.64,14.18 61.8,14.18 60.33,12.7 52.58,12.7 51.31,11.43 48.05,11.43 47.67,11.81 47.67,12.62 v1(48.01,12.95)
  Bottom Layer w0.155: R111.1 v1(48.01,12.95) ; v1(64.52,12.7) 64.52,11.95 D104.2 64.51,11.41 J101.B6 64.51,10.15 63.51,9.15 J101.A6
EXT_LEDS: length 3.4
  Bottom Layer w0.157: J201.3 83.31,13.08 82.8,13.59 82.3,13.59 82.04,13.84 82.04,14.97 LED231.2
I2C1_SCL: length 25.6
  Bottom Layer w0.157: U101.14 32.95,3.05 32.18,2.29 32.18,1.83 31.62,1.27 22.99,1.27 21.34,2.92 19.69,2.92 16.76,5.84 13.08,5.84 12.5,5.26 U106.8
I2C1_SDA: length 32.6
  Bottom Layer w0.157: U101.13 34.63,2.37 34.42,2.16 33.53,2.16 33.22,1.85 R138.1 32.46,0.76 9.78,0.76 9.27,1.27 9.27,3.3 9.85,3.88 12.5,3.88
LED0_BUF: length 12.4
  Top Layer w0.157: v1(26.67,11.56) 28.83,9.4 v1(32,9.4)
  Bottom Layer w0.157: U103.2 23.14,11.57 24.03,11.57 U103.1 24.11,11.56 v1(26.67,11.56) ; U101.29 32.76,10.15 v1(32,9.4)
LED0_DIN: length 6.7
  Bottom Layer w0.157: U103.4 19.73,13.8 18.55,14.98 LED201.4
LED1_DIN: length 3.8
  Bottom Layer w0.157: LED201.2 12.95,20.58 12.43,20.06 LED202.4
LED2_DIN: length 5.2
  Bottom Layer w0.157: LED203.4 10.91,28.69 9.41,27.19 LED202.2
LED3_DIN: length 8.8
  Bottom Layer w0.157: LED204.4 11.69,40.9 10.41,39.62 10.41,37.85 9.41,36.84 LED203.2
LED4_DIN: length 3.8
  Bottom Layer w0.157: LED205.4 18.04,35.82 17.52,35.3 LED204.2
LED5_DIN: length 11.4
  Bottom Layer w0.157: LED206.4 14.48,30.75 14.48,31.75 14.99,32.26 16.26,32.26 17.78,30.73 17.78,29.21 18.29,28.7 20.57,28.7 21.07,29.2 LED205.2
LED6_DIN: length 3.8
  Bottom Layer w0.157: LED206.2 17.52,25.14 18.03,25.65 19.56,25.65 LED207.4
LED7_DIN: length 16.8
  Bottom Layer w0.157: LED208.4 31.23,13.96 30.86,13.59 28.19,13.59 27.69,14.1 27.69,17.65 27.18,18.16 21.72,18.16 21.07,18.81 LED207.2
LED8_DIN: length 3.8
  Bottom Layer w0.157: LED209.4 27.67,20.06 28.19,20.58 LED208.2
LED9_DIN: length 5.2
  Bottom Layer w0.157: LED209.2 24.65,27.19 26.15,28.69 LED210.4
LED10_DIN: length 8.8
  Bottom Layer w0.157: LED210.2 24.65,36.84 25.65,37.85 25.65,39.62 26.93,40.9 LED211.4
LED11_DIN: length 3.8
  Bottom Layer w0.157: LED211.2 32.76,35.3 33.28,35.82 LED212.4
LED12_DIN: length 11.4
  Bottom Layer w0.157: LED212.2 36.31,29.2 35.81,28.7 33.53,28.7 33.02,29.21 33.02,30.73 31.5,32.26 30.23,32.26 29.72,31.75 29.72,30.75 LED213.4
LED13_DIN: length 3.8
  Bottom Layer w0.157: LED213.2 32.76,25.14 33.27,25.65 34.8,25.65 LED214.4
LED14_DIN: length 30.1
  Top Layer w0.157: v1(58.42,16) 58.42,19.69 57.53,20.57 53.72,20.57 51.43,18.29 v1(39.37,18.29)
  Bottom Layer w0.157: LED215.4 57.4,14.98 v1(58.42,16) ; v1(39.37,18.29) 37.6,20.06 LED214.2
LED15_DIN: length 3.8
  Bottom Layer w0.157: LED216.4 53.07,20.06 53.59,20.58 LED215.2
LED16_DIN: length 5.2
  Bottom Layer w0.157: LED217.4 51.55,28.69 50.05,27.19 LED216.2
LED17_DIN: length 9.5
  Bottom Layer w0.157: LED218.4 52.33,40.9 51.82,40.39 51.82,37.47 51.37,37.02 50.23,37.02 50.05,36.84 LED217.2
LED18_DIN: length 3.8
  Bottom Layer w0.157: LED219.4 58.68,35.82 58.16,35.3 LED218.2
LED19_DIN: length 11.4
  Bottom Layer w0.157: LED220.4 55.12,30.75 55.12,31.75 55.63,32.26 56.9,32.26 58.42,30.73 58.42,29.21 58.93,28.7 61.21,28.7 61.71,29.2 LED219.2
LED20_DIN: length 3.8
  Bottom Layer w0.157: LED220.2 58.16,25.14 58.67,25.65 60.2,25.65 LED221.4
LED21_DIN: length 16.1
  Bottom Layer w0.157: LED221.2 61.72,20.05 61.72,18.8 62.29,18.22 68.01,18.22 68.71,17.53 68.71,14.35 69.34,13.72 70.99,13.72 71.87,14.59 LED222.4
LED22_DIN: length 3.8
  Bottom Layer w0.157: LED223.4 68.31,20.06 68.83,20.58 LED222.2
LED23_DIN: length 5.2
  Bottom Layer w0.157: LED223.2 65.29,27.19 66.79,28.69 LED224.4
LED24_DIN: length 8.8
  Bottom Layer w0.157: LED225.4 67.57,40.9 66.29,39.62 66.29,37.85 65.29,36.84 LED224.2
LED25_DIN: length 3.8
  Bottom Layer w0.157: LED226.4 73.92,35.82 73.4,35.3 LED225.2
LED26_DIN: length 11.4
  Bottom Layer w0.157: LED227.4 70.36,30.75 70.36,31.75 70.87,32.26 72.14,32.26 73.66,30.73 73.66,29.21 74.17,28.7 76.45,28.7 76.95,29.2 LED226.2
LED27_DIN: length 3.8
  Bottom Layer w0.157: LED227.2 73.4,25.14 73.91,25.65 75.44,25.65 LED228.4
LED28_BUF: length 19.8
  Bottom Layer w0.157: U101.40 38.63,11.33 39.24,11.94 39.24,14.48 40.89,16.13 40.89,19.69 38.86,21.72 38.86,25.65 38.52,25.99 U105.1 U105.2
LED28_DIN: length 10.2
  Bottom Layer w0.157: U105.4 40.72,29.63 39.12,31.24 39.12,34.8 40.14,35.82 LED229.4
LED29_DIN: length 5.2
  Bottom Layer w0.157: LED230.4 42.43,27.04 42.42,27.05 42.42,27.43 43.93,28.94 LED229.2
LED30_DIN: length 49.4
  Bottom Layer w0.157: LED231.4 78.75,20.58 77.85,19.69 77.85,17.78 76.83,16.76 75.31,16.76 71.5,12.95 68.83,12.95 67.82,13.97 67.82,16.38 67.18,17.02 61.72,17.02 57.91,13.21 54.61,13.21 54.1,13.72 54.1,15.49 52.83,16.76 50.04,16.76 46.74,20.06 LED230.2
LIGHT_DET: length 34.3
  Bottom Layer w0.157: R135.1 41.28,39.52 39.69,39.52 C247.2 39.62,37.47 38.1,35.94 38.1,30.48 37.34,29.72 37.34,25.53 37.85,25.02 37.85,21.34 40.13,19.05 40.13,16.51 38.53,14.91 R136.1 38.53,11.86 38.23,11.56 U101.39
QSPI_SCLK: length 17.6
  Top Layer w0.157: 49.66,4.7 49.66,3.58 49.02,2.95 47.6,2.95 46.99,3.56 44.2,3.56 v1(42.93,4.83)
  Bottom Layer w0.157: U104.6 50.93,8 50.55,7.62 50.55,6.6 49.66,5.72 v1(49.66,4.83) ; U101.52 42.15,5.6 v1(42.93,4.83)
QSPI_SD0: length 13.8
  Top Layer w0.157: v1(44.7,4.32) 44.89,4.32 46.55,5.97 46.67,5.97 48.2,7.49 v1(49.66,7.49)
  Bottom Layer w0.157: U104.5 v1(49.66,7.49) ; v1(44.7,4.32) 44.45,4.06 42.7,4.06 41.56,5.2 U101.53
QSPI_SD1: length 16.3
  Top Layer w0.157: v1(52.2,5.59) 51.56,5.59 50.93,6.22 48.51,6.22 46.74,4.45 v1(46.74,4.32)
  Bottom Layer w0.157: U101.55 41.22,4.4 42.32,3.3 45.72,3.3 v1(46.74,4.32) ; U104.2 v1(52.2,5.59)
QSPI_SD2: length 17
  Top Layer w0.157: v1(51.56,6.86) 48.26,6.86 v1(45.72,4.32)
  Bottom Layer w0.157: U101.54 41.42,4.8 42.55,3.68 45.08,3.68 v1(45.72,4.32) ; v1(51.56,6.86) 51.56,6.22 50.93,5.59 U104.3
QSPI_SD3: length 17.4
  Top Layer w0.157: v1(52.2,8.26) 49.02,8.26 48.26,9.02 46.86,9.02 46.48,8.64 46.48,6.6 44.83,4.95 44.07,4.95 v1(43.94,4.83)
  Bottom Layer w0.157: v1(43.94,4.83) 42.76,6 U101.51 ; U104.7 v1(52.2,8.26)
QSPI_SS: length 19.5
  Top Layer w0.157: v1(47.75,4.32) 48.64,4.32 49.02,4.7 49.02,5.21 49.4,5.59 50.42,5.59 51.18,4.83 v1(53.47,4.83)
  Bottom Layer w0.157: U101.56 41.08,4 42.16,2.92 46.36,2.92 v1(47.75,4.32) ; R124.2 54.79,5.01 54.61,4.83 v1(53.47,4.83) U104.1
RESET_N: length 6.4
  Bottom Layer w0.157: R125.2 32.15,11.65 C127.2 30.99,9.14 31.73,8.4 U101.26
USB_N: length 9.1
  Bottom Layer w0.155: 46.99,11.25 46.99,10.81 47.33,10.48 47.33,10.11 46.99,9.78 45.99,9.78 45.1,8.89 42.93,8.89 42.01,7.98 41.11,7.98 41.08,8 U101.46
USB_P: length 9.7
  Bottom Layer w0.155: 48.01,11.25 48.01,10.81 47.67,10.48 47.67,9.99 47.13,9.45 46.15,9.45 45.25,8.54 43.07,8.54 42.16,7.63 41.11,7.63 41.08,7.6 U101.47
USER_BTN1: length 36.9
  Bottom Layer w0.157: U101.18 32.11,5.2 29.7,2.79 23.88,2.79 21.72,4.95 20.32,4.95 18.03,7.24 18.03,9.65 16.64,11.05 10.29,11.05 9.65,11.68 9.65,16 10.12,16.47 C244.2 10.92,15.57 11.25,15.24
USER_BTN2: length 54.1
  Bottom Layer w0.157: U101.17 32.24,4.8 29.73,2.29 23.62,2.29 21.46,4.45 20.07,4.45 17.14,7.37 17.14,9.02 16,10.16 9.65,10.16 8.51,11.3 8.51,19.3 7.11,20.7 4.32,20.7 3.56,21.46 3.56,25.27 4.23,25.95 C245.2 7.62,27.51
USER_BTN3: length 43.6
  Bottom Layer w0.157: R134.2 C246.2 4.48,14.01 3.56,13.08 3.56,10.03 4.44,9.14 15.49,9.14 16.26,8.38 16.26,7.49 19.81,3.94 21.21,3.94 23.37,1.78 29.76,1.78 32.38,4.4 U101.16
X_R: length 3.5
  Bottom Layer w0.157: R121.1 26.24,8.78 C124.1 24.34,8.85 Y101.3
XIN: length 13.1
  Bottom Layer w0.157: Y101.1 22.52,5.68 23.24,4.95 24.04,4.95 C123.1 24.22,4.95 27.69,4.95 28.25,4.39 R120.2 29.54,4.39 31.15,6 U101.20
XOUT: length 8.1
  Bottom Layer w0.157: R121.2 27.1,6.43 28.27,5.26 R120.1 29.64,5.26 30.79,6.4 U101.21
$1N6734: length 4.3
  Bottom Layer w0.157: J101.B5 66.1,10.48 66.67,11.05 66.67,12.83 66.22,13.28 66.22,13.72
$1N6739: length 2.8
  Bottom Layer w0.157: J101.A5 62.51,7.98 62.94,7.55 64.26,7.55
$1N8227: length 22.9
  Bottom Layer w0.157: SW101.4 SW101.3 51.81,13.21 53.47,11.56 54.1,11.56 54.74,10.92 56.64,10.92 57.15,10.41 57.15,4.83 56.46,4.14 55.88,4.14 55.88,2.97
$1N8669: length 14.5
  Top Layer w0.157: v1(37.91,13.78) 38.23,14.1 42.55,14.1 v1(43.18,13.46)
  Bottom Layer w0.157: v1(37.91,13.78) 37.91,14.29 37.54,14.66 SW102.4 35.56,14.66 33.53,12.62 32.26,12.62 ; SW102.3 42.74,14.66 43.18,14.22 v1(43.18,13.46)
$1N9334: length 1.9
  Bottom Layer w0.157: 58.17,2.97 58.62,2.97 59.05,2.54 LED102.1
$1N23191: length 12.6
  Bottom Layer w0.157: SW103.4 SW103.3 11.24,13.53 12.12,14.4 R130.1 12.19,15.31 R129.1
$1N23881: length 16.5
  Bottom Layer w0.157: SW104.3 SW104.4 2.86,31.94 4.75,30.05 7.62,30.05 R132.1
$1N24080: length 16
  Bottom Layer w0.157: R134.1 7.62,17.35 4.88,17.35 2.98,19.24 SW105.4 SW105.3
$2N19103: length 23.8
  Bottom Layer w0.157: BUZZER1.1 83.79,33.4 C243.2 D105.1 82.17,33.56 82.17,26.8 84.71,24.26 R127.1
$2N19108: length 18
  Bottom Layer w0.157: Q1.3 80.3,24.55 81.53,25.78 81.53,31.85 79.79,33.59 ; BUZZER1.2 79.79,33.59 ; 79.79,33.59 D105.2

## Copper pours and planes (outline as drawn; the poured copper is in the pictures)
+3V3 on Top Layer: 0.64,32.77 10.8,32.77 10.8,22.73 16.26,17.27 24.77,17.27 24.77,12.06 28.07,8.76 32.64,8.76 32.64,11.43 33.15,11.94 39.38,11.94 40.06,11.25 43.69,11.25 43.69,6.98 42.04,5.33 42.04,4.45 43.43,3.05 52.83,3.05 54.1,4.32 54.1,7.49 53.59,8 53.59,10.97 56.85,10.97 59.97,7.85 67.92,7.85 70.61,10.54 70.61,16.64 71.5,17.53 77.98,17.53 77.98,11.68 69.09,2.79 69.09,0.51 35.31,0.51 35.31,2.03 20.05,2.03 13.32,8.76 0.64,8.76
+3V3 on Bottom Layer: 75.95,6.6 75.95,9.53 76.71,10.29 76.71,12.32 76.07,12.32 75.44,12.95 75.31,12.95 75.06,13.21 75.06,13.59 75.31,13.84 77.72,13.84 78.61,12.95 78.61,7.9 77.32,6.6
+5V_LEDS on Top Layer: 11.3,42.67 11.3,22.99 16.51,17.78 78.23,17.78 78.23,11.68 69.34,2.79 69.34,0.51 85.85,0.51 85.85,42.67
+5V_LEDS on Bottom Layer: 69.47,2.41 71.88,2.41 71.88,0.51 69.47,0.51
+5V_USB on Top Layer: 69.47,11.94 72.01,11.94 72.01,10.92 71.12,10.03 69.47,10.03
+5V_USB on Bottom Layer: 69.6,11.68 72.26,11.68 72.26,9.91 69.6,9.91
GND on Bottom Layer: 45.85,42.67 51.43,42.67 51.43,37.47 45.85,37.47
GND on Bottom Layer: 72.26,0.89 72.26,4.7 73.28,5.72 73.28,11.56 73.79,12.06 75.41,12.06 75.41,6.1 77.09,6.1 77.09,0.89
GND on Inner1: 0.26,42.92 86.1,42.92 86.1,0.26 0.26,0.26
GND on Inner2: 0.26,42.92 86.1,42.92 86.1,0.26 0.26,0.26

Small or netless copper shapes (teardrops, artwork), in the pictures only: 31 on Inner1, 31 on Inner2

## Text on the board
Bottom Silkscreen Layer: USR2 | USR3 | USR1 | RST | LIGHT / SENSOR | BOOT | SGP | EXT LED
Document Layer: Clock © 2025 by FEDEVEL / is licensed under Creative Commons / Attribution-NonCommercial-ShareAlike 4.0 International / https://creativecommons.org/licenses/by-nc-sa/4.0/
Top Silkscreen Layer: CR1025 | (C)2025 FEDEVEL | CLOCK V1I1 | LEARN HOW TO DESIGN BOARDS | FEDEVEL ONLINE COURSES | www.fedevel.com
